# Altium schematic sheet 04_Sensors.SchDoc: ESPSense - Sensors
size A4; SheetNumber: 4; SheetTotal: 4; sk_ProjectName: WInFiDEL Sensor; sk_Title: Hall Sensor + ADC
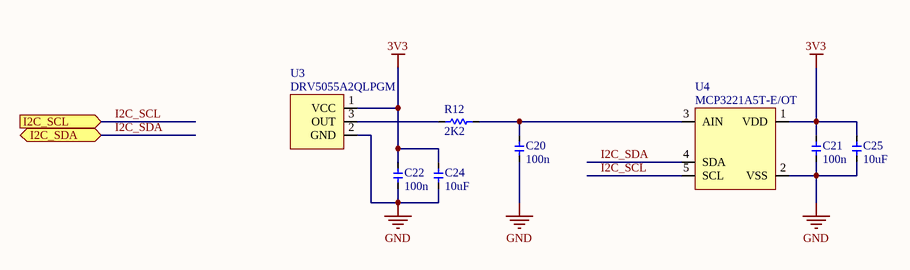
[diagram p0: 04_Sensors.SchDoc]

## Parts
C20  value 100n  [0603 - CAP]  (hidden comment: Cap)
C21  value 100n  [0603 - CAP]  (hidden comment: Cap)
C22  value 100n  [0603 - CAP]  (hidden comment: Cap)
C24  value 10uF  [0603 - CAP]  (hidden comment: Cap)
C25  value 10uF  [0603 - CAP]  (hidden comment: Cap)
R12  value 2K2  [0603]  (hidden comment: Res)
U3  DRV5055A2QLPGM  [SS490A]
U4  MCP3221A5T-E/OT  [SOT95P270X145-5N]

## Ports
I2C_SCL (in), I2C_SDA (bidir)

## Nets
3V3: C21.2 C22.2 C24.2 C25.2 U3.1(VCC) U4.1(VDD)
GND: C20.1 C21.1 C22.1 C24.1 C25.1 U3.2(GND) U4.2(VSS)
I2C_SCL: U4.5(SCL) ; port I2C_SCL
I2C_SDA: U4.4(SDA) ; port I2C_SDA
NetC20_2: C20.2 R12.2 U4.3(AIN)
NetR12_1: R12.1 U3.3(OUT)

## Notes on the sheet
- Page
- Title
- www.SasaKaranovic.com <http://www.SasaKaranovic.com>
- of

## Library data of the parts
C20-C22 = Cap: Capacitor; Manufacturer: Samsung Electro-Mechanics; Manufacturer Part Number: CL10B104KB8NNNC; Temp Rating: X7R; Voltage: 50V; Distributor Part Number: C1591; Distributor: LCSC
C24 C25 = Cap: Capacitor; Manufacturer: Samsung Electro-Mechanics; Manufacturer Part Number: CL21A106KAYNNNE; Voltage: 25V; Distributor Part Number: C15850; Distributor: LCSC
R12 = Res: Resistor; Manufacturer: YAGEO; Manufacturer Part Number: AC0603FR-072K2L; Power Rating: 100mW; Tolerance: 1%; Distributor: LCSC; Distributor Part Number: C125931
U3 = DRV5055A2QLPGM: Hall Effect Sensor Single Axis Radial Lead; Manufacturer: Texas Instruments; Manufacturer Part Number: DRV5055A3QLPGM; Distributor: LCSC; Distributor Part Number: C266124
U4 = MCP3021A5T-E/OT: 10 Bit Analog to Digital Converter 1 Input 1 SAR SOT-23-5; Manufacturer: Microchip Technology; Manufacturer Part Number: MCP3221A5T-E/OT; Distributor: LCSC; Distributor Part Number: C625475